# EAGLE design IOIO Sensors (EAGLE 5.11)
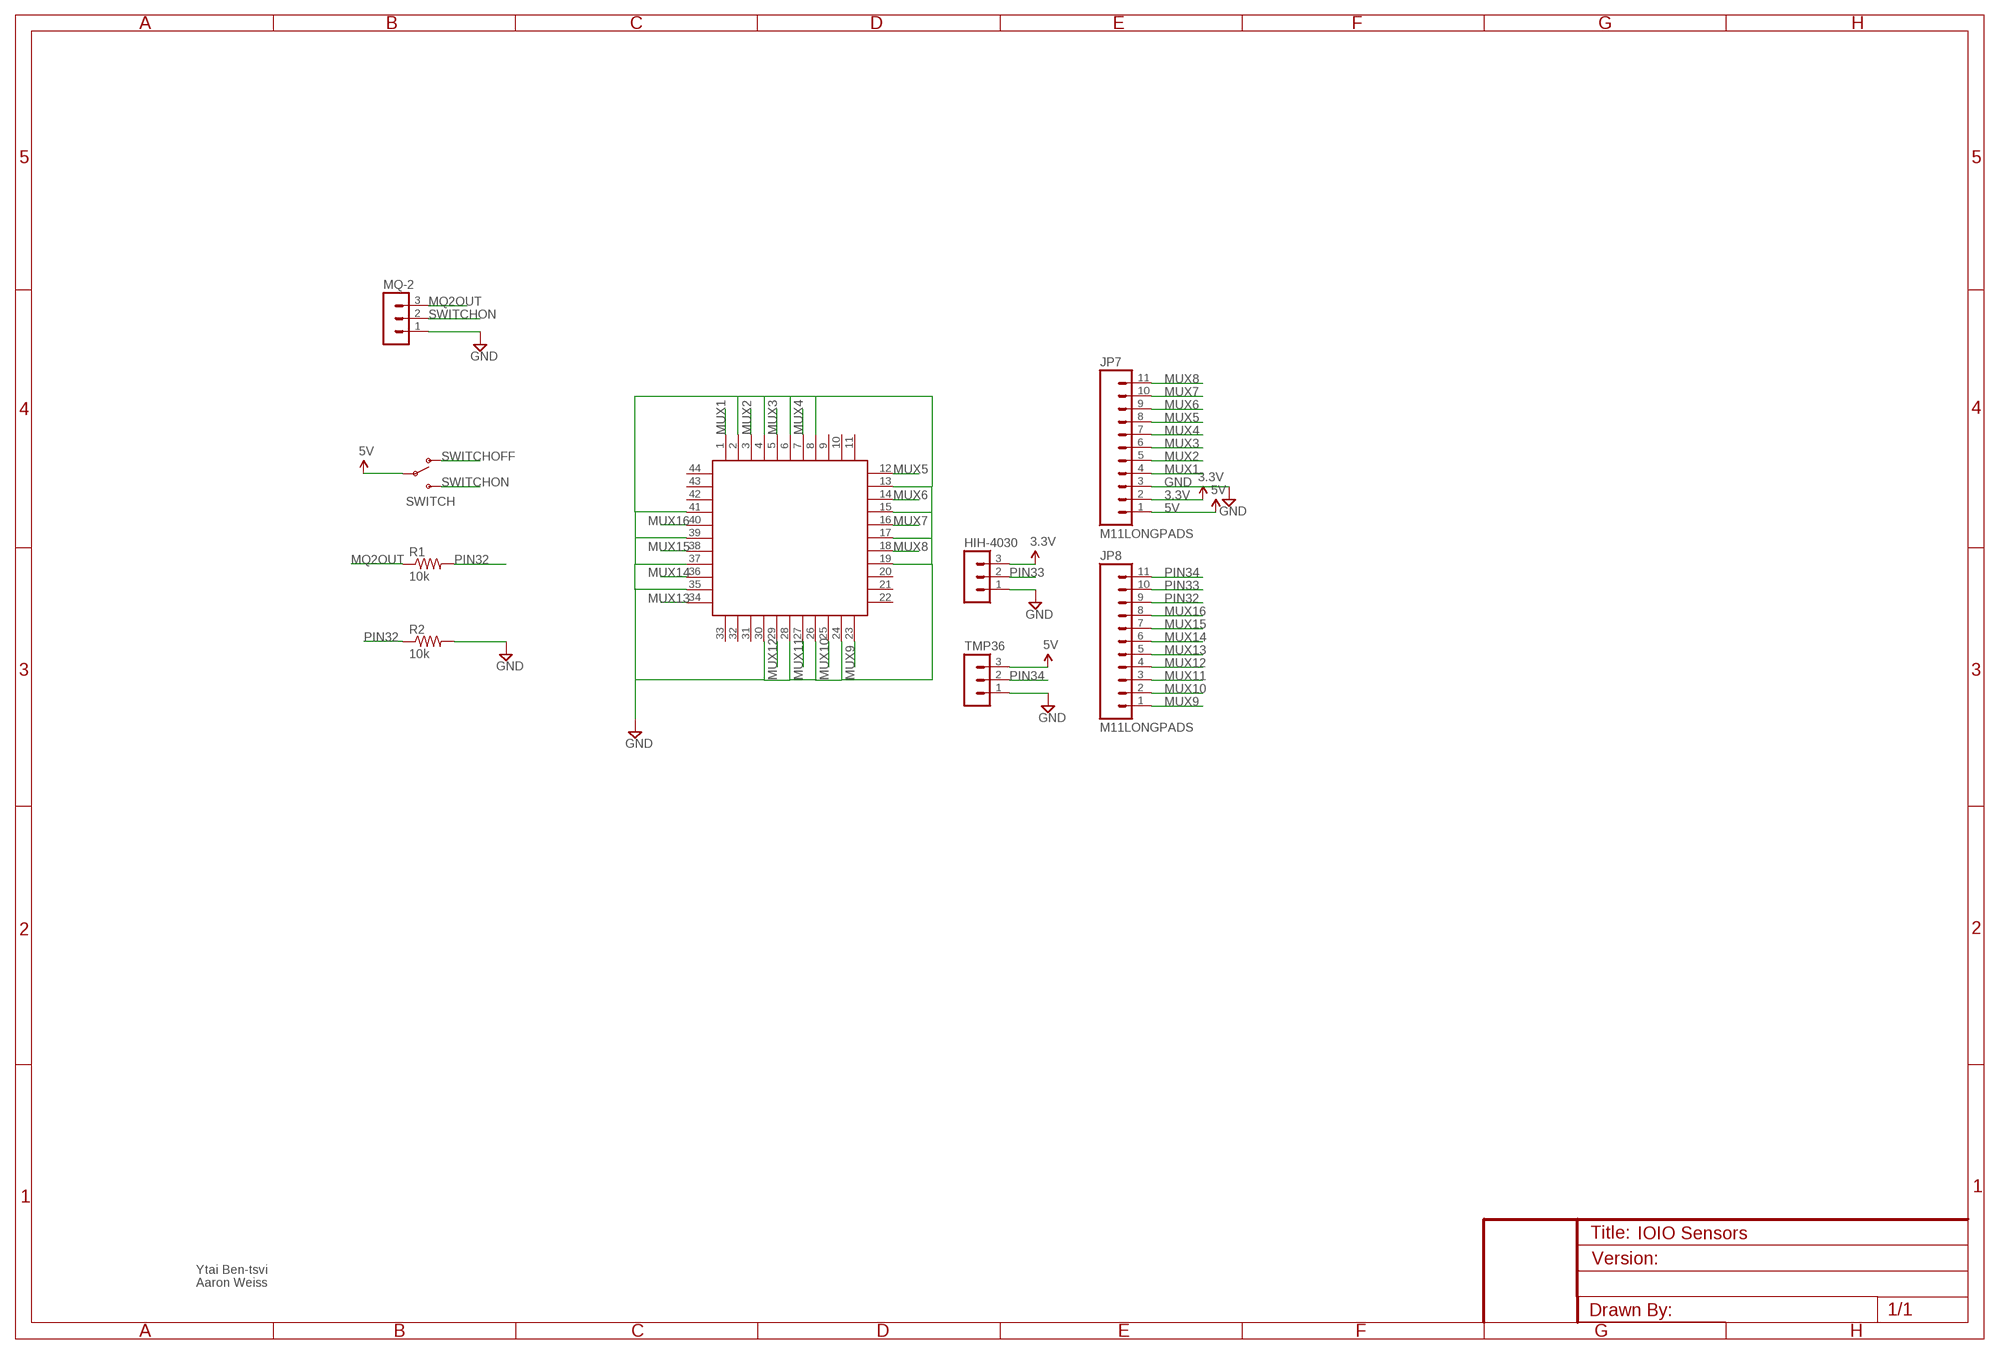
[diagram p0: schematic, sheet 1]

## Parts
HIH-4030  MA03-1  [MA03-1]
JP7  M11LONGPADS  [1X11_LONGPADS]
JP8  M11LONGPADS  [1X11_LONGPADS]
MQ-2  MA03-1  [MA03-1]
R1  10k  R-US_0207/7  [0207/7]
R2  10k  R-US_0207/7  [0207/7]
SWITCH  SWITCH-SPSTPTH_LOCK  [SWITCH-SPDT_LOCK.007S]
TMP36  MA03-1  [MA03-1]
U$4  S44  [S44]

## Nets
3.3V: HIH-4030.3 JP7.2
5V: JP7.1 SWITCH.2(P) TMP36.3
GND: HIH-4030.1 JP7.3 MQ-2.1 R2.2 TMP36.1 U$4.2 U$4.4 U$4.6 U$4.8 U$4.13 U$4.15 U$4.17 U$4.19 U$4.24 U$4.26 U$4.28 U$4.30 U$4.35 U$4.37 U$4.39 U$4.41
MQ2OUT: MQ-2.3 R1.1
MUX1: JP7.4 U$4.1
MUX2: JP7.5 U$4.3
MUX3: JP7.6 U$4.5
MUX4: JP7.7 U$4.7
MUX5: JP7.8 U$4.12
MUX6: JP7.9 U$4.14
MUX7: JP7.10 U$4.16
MUX8: JP7.11 U$4.18
MUX9: JP8.1 U$4.23
MUX10: JP8.2 U$4.25
MUX11: JP8.3 U$4.27
MUX12: JP8.4 U$4.29
MUX13: JP8.5 U$4.34
MUX14: JP8.6 U$4.36
MUX15: JP8.7 U$4.38
MUX16: JP8.8 U$4.40
PIN32: JP8.9 R1.2 R2.1
PIN33: HIH-4030.2 JP8.10
PIN34: JP8.11 TMP36.2
SWITCHOFF: SWITCH.1(O)
SWITCHON: MQ-2.2 SWITCH.3(S)
Unconnected: U$4.9 U$4.10 U$4.11 U$4.20 U$4.21 U$4.22 U$4.31 U$4.32 U$4.33 U$4.42 U$4.43 U$4.44

## Notes on the sheet
- Ytai Ben-tsvi
- Aaron Weiss

## Library data of the parts
HIH-4030 MQ-2 TMP36 = con-lstb:MA03-1: PIN HEADER; OC_FARNELL: unknown; OC_NEWARK: unknown
JP7 JP8 = SparkFun:M11: Header 11 Standard 11-pin 0.1" header. Use with straight break away headers (SKU : PRT-00116), right angle break away headers (PRT-00553), swiss pins (PRT-00743), machine pins (PRT-00117), and female headers (PRT-00115).
R1 R2 = resistor:R-US_: RESISTOR, American symbol
SWITCH = SparkFun:SWITCH-SPST: SPST Switch Simple slide switch. Spark Fun Electronics SKU : COM-00102
U$4 = plcc-socket:S44: 44-pin PLCC through-hole socket

## Board
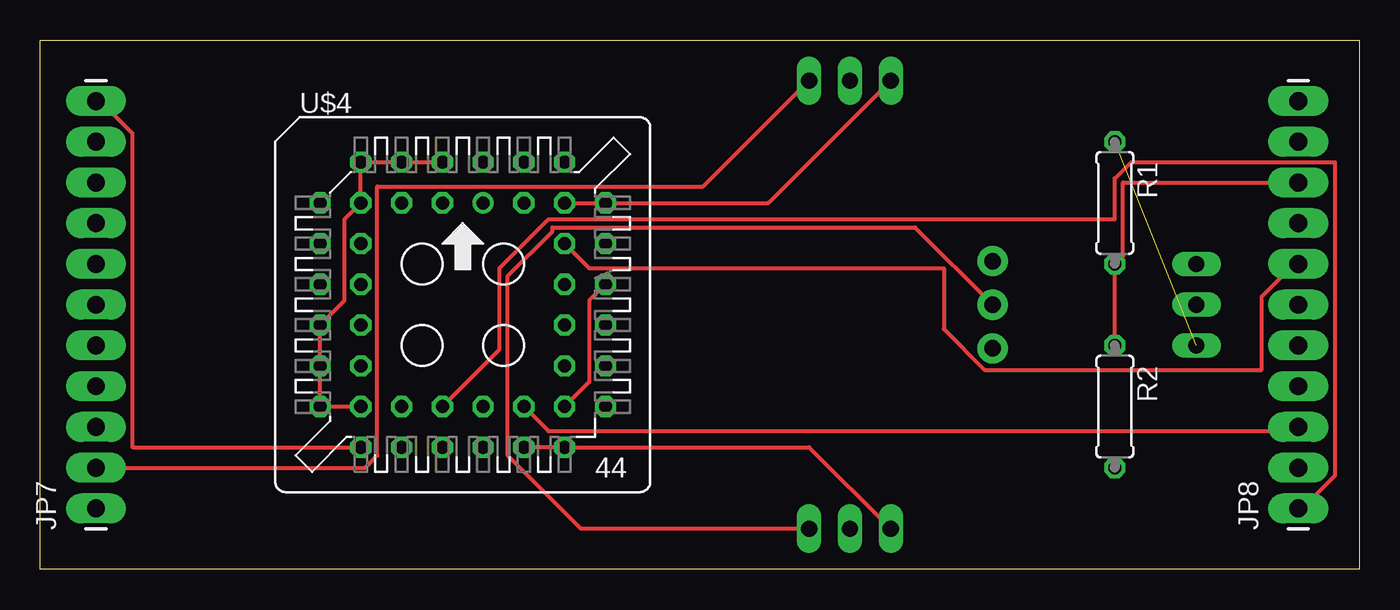
[diagram p1: board, top side]
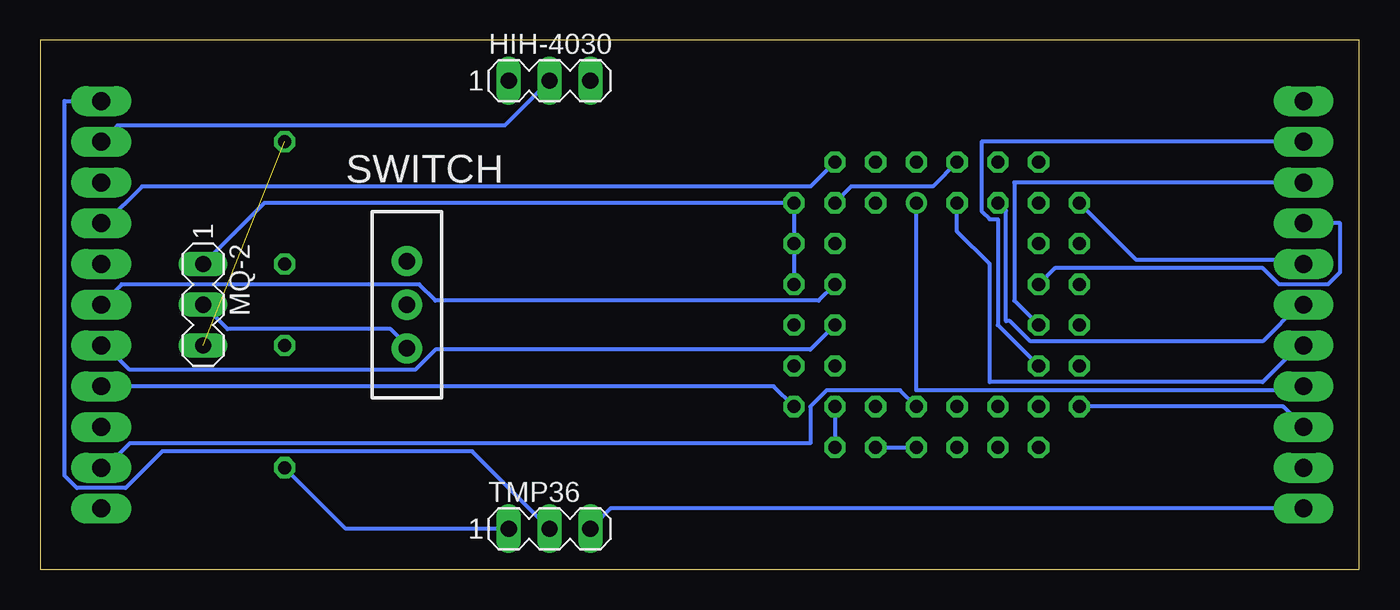
[diagram p2: board, bottom side, seen from below]

Size 82.22 x 33.01 mm. Coordinates in mm from the lower left corner, seen from the top.
Outline: 82.22,0 0,0 0,33.01 82.22,33.01 82.22,0
Copper layers (1*16): Top 0.035mm / dielectric 1.5mm / Bottom 0.035mm
Design rules "default *": minimum track width 10mil, minimum drill 24mil, track to track 8mil, track to pad 8mil, pad to pad 8mil, via to via 8mil, smd to smd 8mil, copper to edge 40mil, drill to drill 8mil, minimum pad ring 10mil, minimum via ring 8mil, stop-mask expansion 4mil, vias tented up to drill 0mil, thermal gap 10mil

### Footprints (pad centres in the part's own frame; a part is rotated, then mirrored left to right if it is on the bottom)
MA03-1 = drill 1.016 long: 1 -2.54,0; 2 0,0; 3 2.54,0
1X11_LONGPADS = drill 1.118 pad 1.88 long: 1 0,0; 2 2.54,0; 3 5.08,0; 4 7.62,0; 5 10.16,0; 6 12.7,0; 7 15.24,0; 8 17.78,0; 9 20.32,0; 10 22.86,0; 11 25.4,0
0207/7 = drill 0.813 octagon: 1 -3.81,0; 2 3.81,0
SWITCH-SPDT_LOCK.007S = drill 1.016 pad 1.88 round: 1 0,2.718; 2 0,0; 3 0,-2.718
S44 = drill 0.813 round: 1 1.27,6.35 | drill 0.813 octagon: 2 -1.27,8.89; 3 -1.27,6.35; 4 -3.81,8.89; 5 -3.81,6.35; 6 -6.35,8.89; 7 -8.89,6.35; 8 -6.35,6.35; 9 -8.89,3.81; 10 -6.35,3.81; 11 -8.89,1.27; 12 -6.35,1.27; 13 -8.89,-1.27; 14 -6.35,-1.27; 15 -8.89,-3.81; 16 -6.35,-3.81; 17 -8.89,-6.35; 18 -6.35,-8.89; 19 -6.35,-6.35; 20 -3.81,-8.89; 21 -3.81,-6.35; 22 -1.27,-8.89; 23 -1.27,-6.35; 24 1.27,-8.89; 25 1.27,-6.35; 26 3.81,-8.89; 27 3.81,-6.35; 28 6.35,-8.89; 29 8.89,-6.35; 30 6.35,-6.35; 31 8.89,-3.81; 32 6.35,-3.81; 33 8.89,-1.27; 34 6.35,-1.27; 35 8.89,1.27; 36 6.35,1.27; 37 8.89,3.81; 38 6.35,3.81; 39 8.89,6.35; 40 6.35,8.89; 41 6.35,6.35; 42 3.81,8.89; 43 3.81,6.35; 44 1.27,8.89

### Placement (x,y rotation side)
HIH-4030  50.47,30.48 0 bottom
JP7  3.48,3.81 90 top
JP8  78.41,3.81 90 top
MQ-2  72.06,16.51 270 bottom
R1  66.98,22.86 270 top
R2  66.98,10.16 270 top
SWITCH  59.36,16.51 0 bottom
TMP36  50.47,2.54 0 bottom
U$4  26.34,16.51 0 top

### Tracks (layer width: path | path; a pad name or v marks a point on that pad's centre or on a via)
3.3V
  Top 0.254: HIH-4030.3 41.33,23.88 21.01,23.88 21.01,7.11 20.24,6.35 JP7.2
5V
  Top 0.254: SWITCH.2 54.53,21.34 31.93,21.34 31.93,21.08 29.13,18.29 29.13,7.11 33.71,2.54 TMP36.3
  Bottom 0.254: TMP36.3 46.66,3.81 JP7.1
GND
  Top 0.254: U$4.19 U$4.17 U$4.15 U$4.13 18.97,16.76 18.97,21.84 U$4.8 U$4.6 U$4.4 U$4.2 | U$4.26 U$4.28 47.93,7.62 TMP36.1 | U$4.41 U$4.39 45.39,22.86 HIH-4030.1 | U$4.30 34.21,11.68 34.21,16.76 U$4.35
  Bottom 0.254: JP7.3 4.75,10.16 U$4.17 | R2.2 63.17,2.54 TMP36.1 | U$4.26 U$4.24 | U$4.30 U$4.28 | U$4.35 U$4.37 U$4.39 68.25,22.86 MQ-2.1 | U$4.2 26.59,23.88 31.67,23.88 U$4.41
MQ2OUT  (1 unrouted)
MUX1
  Bottom 0.254: U$4.1 27.61,11.18 3.73,11.18 JP7.4
MUX2
  Bottom 0.254: U$4.3 25.07,21.08 23.04,19.05 23.04,11.68 6.02,11.68 3.73,13.97 JP7.5
MUX3
  Bottom 0.254: U$4.5 22.02,22.35 22.02,15.49 21.77,15.49 20.5,14.22 6.02,14.22 3.73,16.51 JP7.6
MUX4
  Bottom 0.254: U$4.7 13.89,19.3 3.73,19.3 JP7.7
MUX5
  Bottom 0.254: U$4.12 18.97,18.8 6.02,18.8 5,17.78 1.96,17.78 1.19,18.54 1.19,21.59 JP7.8
MUX6
  Bottom 0.254: U$4.14 21.51,16.76 21.51,24.13 JP7.9
MUX7
  Bottom 0.254: U$4.16 22.53,15.24 22.53,21.84 23.04,21.84 23.55,22.35 23.55,26.67 JP7.10
MUX8
  Top 0.254: U$4.18 5.77,7.62 5.77,27.18 3.73,29.21 JP7.11
MUX9
  Top 0.254: U$4.23 28.63,13.72 28.63,18.8 31.67,21.84 66.98,21.84 66.98,24.38 68,25.4 80.7,25.4 80.7,5.84 78.66,3.81 JP8.1
MUX10
  Bottom 0.254: U$4.25 28.63,11.18 33.2,11.18 34.21,10.16 34.21,7.87 76.63,7.87 78.16,6.35 JP8.2
MUX11
  Top 0.254: U$4.27 31.67,8.64 78.41,8.64 JP8.3
MUX12
  Bottom 0.254: U$4.29 36.5,11.43 JP8.4
MUX13
  Bottom 0.254: U$4.34 34.21,13.72 57.58,13.72 58.85,12.45 76.63,12.45 78.16,13.97 JP8.5
MUX14
  Bottom 0.254: U$4.36 33.71,16.76 57.58,16.76 58.6,17.78 77.14,17.78 JP8.6
MUX15
  Top 0.254: U$4.38 34.21,18.8 56.31,18.8 56.31,14.99 58.85,12.45 76.12,12.45 76.12,17.02 78.16,19.05 JP8.7
MUX16
  Bottom 0.254: U$4.40 34.21,23.88 75.87,23.88 78.16,21.59 JP8.8
PIN32
  Top 0.254: R2.1 R1.2 67.49,19.56 67.49,24.13 JP8.9
PIN33
  Bottom 0.254: HIH-4030.2 53.26,27.69 77.39,27.69 JP8.10
PIN34
  Bottom 0.254: TMP36.2 55.3,7.37 74.6,7.37 76.89,5.08 79.93,5.08 80.7,5.84 80.7,29.21 JP8.11
SWITCHON
  Bottom 0.254: MQ-2.2 70.54,14.99 60.38,14.99 59.36,13.97 SWITCH.3